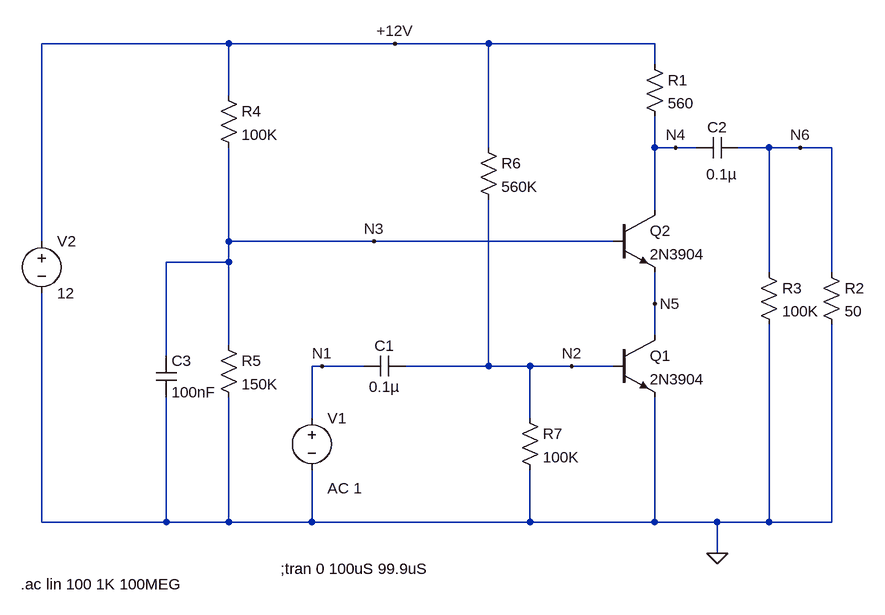
[diagram p0: schematic CascodeAmp2.asc]
CascodeAmp2.asc, the LTspice schematic file:
Version 4
SHEET 1 980 680
WIRE -416 -432 -704 -432
WIRE -160 -432 -416 -432
WIRE -16 -432 -160 -432
WIRE 240 -432 -16 -432
WIRE 240 -400 240 -432
WIRE -416 -352 -416 -432
WIRE -16 -272 -16 -432
WIRE 240 -272 240 -320
WIRE 272 -272 240 -272
WIRE 304 -272 272 -272
WIRE 416 -272 368 -272
WIRE 464 -272 416 -272
WIRE 512 -272 464 -272
WIRE 240 -176 240 -272
WIRE -704 -128 -704 -432
WIRE -416 -128 -416 -272
WIRE -192 -128 -416 -128
WIRE 176 -128 -192 -128
WIRE -416 -96 -416 -128
WIRE -416 -96 -512 -96
WIRE 416 -80 416 -272
WIRE 512 -80 512 -272
WIRE 240 -32 240 -80
WIRE 240 16 240 -32
WIRE -416 32 -416 -96
WIRE -512 48 -512 -96
WIRE -272 64 -288 64
WIRE -208 64 -272 64
WIRE -16 64 -16 -192
WIRE -16 64 -144 64
WIRE 48 64 -16 64
WIRE 112 64 48 64
WIRE 176 64 112 64
WIRE -288 144 -288 64
WIRE 48 144 48 64
WIRE -704 304 -704 -48
WIRE -512 304 -512 112
WIRE -512 304 -704 304
WIRE -416 304 -416 112
WIRE -416 304 -512 304
WIRE -288 304 -288 224
WIRE -288 304 -416 304
WIRE 48 304 48 224
WIRE 48 304 -288 304
WIRE 240 304 240 112
WIRE 240 304 48 304
WIRE 336 304 240 304
WIRE 416 304 416 0
WIRE 416 304 336 304
WIRE 512 304 512 0
WIRE 512 304 416 304
WIRE 336 352 336 304
FLAG 336 352 0
FLAG -272 64 N1
FLAG -192 -128 N3
FLAG -160 -432 +12V
FLAG 272 -272 N4
FLAG 464 -272 N6
FLAG 240 -32 N5
FLAG 112 64 N2
SYMBOL npn 176 16 R0
SYMATTR InstName Q1
SYMATTR Value 2N3904
SYMBOL cap -144 48 R90
WINDOW 0 0 32 VBottom 2
WINDOW 3 32 32 VTop 2
SYMATTR InstName C1
SYMATTR Value 0.1µ
SYMBOL res 224 -416 R0
SYMATTR InstName R1
SYMATTR Value 560
SYMBOL voltage -288 128 R0
WINDOW 123 24 124 Left 2
WINDOW 39 0 0 Left 0
SYMATTR Value2 AC 1
SYMATTR InstName V1
SYMATTR Value ""
SYMBOL voltage -704 -144 R0
SYMATTR InstName V2
SYMATTR Value 12
SYMBOL cap 368 -288 R90
WINDOW 0 0 32 VBottom 2
WINDOW 3 41 25 VTop 2
SYMATTR InstName C2
SYMATTR Value 0.1µ
SYMBOL npn 176 -176 R0
SYMATTR InstName Q2
SYMATTR Value 2N3904
SYMBOL res -432 -368 R0
SYMATTR InstName R4
SYMATTR Value 100K
SYMBOL res -432 16 R0
SYMATTR InstName R5
SYMATTR Value 150K
SYMBOL res -32 -288 R0
SYMATTR InstName R6
SYMATTR Value 560K
SYMBOL res 32 128 R0
SYMATTR InstName R7
SYMATTR Value 100K
SYMBOL cap -528 48 R0
SYMATTR InstName C3
SYMATTR Value 100nF
SYMBOL res 496 -96 R0
SYMATTR InstName R2
SYMATTR Value 50
SYMBOL res 400 -96 R0
SYMATTR InstName R3
SYMATTR Value 100K
TEXT -336 376 Left 2 !;tran 0 100uS 99.9uS
TEXT -736 400 Left 2 !.ac lin 100 1K 100MEG

The netlist it stands for:
* CascodeAmp2.asc
Q1 N5 N2 0 0 2N3904
C1 N2 N1 0.1µ
R1 +12V N4 560
V1 N1 0 AC 1
V2 +12V 0 12
C2 N6 N4 0.1µ
Q2 N4 N3 N5 0 2N3904
R4 +12V N3 100K
R5 N3 0 150K
R6 +12V N2 560K
R7 N2 0 100K
C3 N3 0 100nF
R2 N6 0 50
R3 N6 0 100K
.model NPN NPN
.model PNP PNP
.lib standard.bjt
;tran 0 100uS 99.9uS
.ac lin 100 1K 100MEG
.backanno
.end

* Results of the author's LTspice run, read from the files saved beside the schematic
* Operating Point, zero values left out:
*   V(n5) = 5.701 V
*   V(n2) = 691.6 mV
*   V(+12v) = 12 V
*   V(n4) = 9.688 V
*   V(n3) = 6.393 V
*   Ic(Q2) = 4.129 mA
*   Ib(Q2) = 13.46 µA
*   Ie(Q2) = -4.142 mA
*   Ic(Q1) = 4.142 mA
*   Ib(Q1) = 13.28 µA
*   Ie(Q1) = -4.155 mA
*   I(R7) = 6.916 µA
*   I(R6) = 20.19 µA
*   I(R5) = 42.62 µA
*   I(R4) = 56.07 µA
*   I(R1) = 4.129 mA
*   I(V2) = -4.205 mA
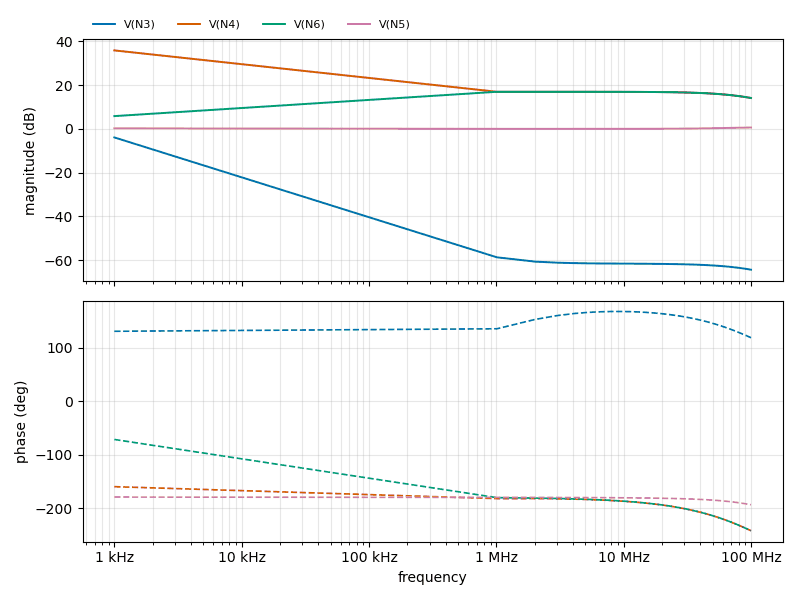
[diagram p1: AC Analysis of CascodeAmp2.asc, plotted from the saved traces]
* AC Analysis, 1 run:
*   V(N3): -3.91 dB at 1 kHz, -64.42 dB at 100 MHz, peak -3.91 dB at 1 kHz, 3 dB below the peak at 1.462 kHz
*   V(N4): 35.91 dB at 1 kHz, 14.13 dB at 100 MHz, peak 35.91 dB at 1 kHz, 3 dB below the peak at 3.006 kHz
*   V(N6): 5.84 dB at 1 kHz, 14.13 dB at 100 MHz, peak 16.98 dB at 1.011 MHz, 3 dB below the peak at 155.8 kHz
*   V(N5): 0.25 dB at 1 kHz, 0.62 dB at 100 MHz, peak 0.62 dB at 100 MHz